# EAGLE design usb-uart (EAGLE 5.06)
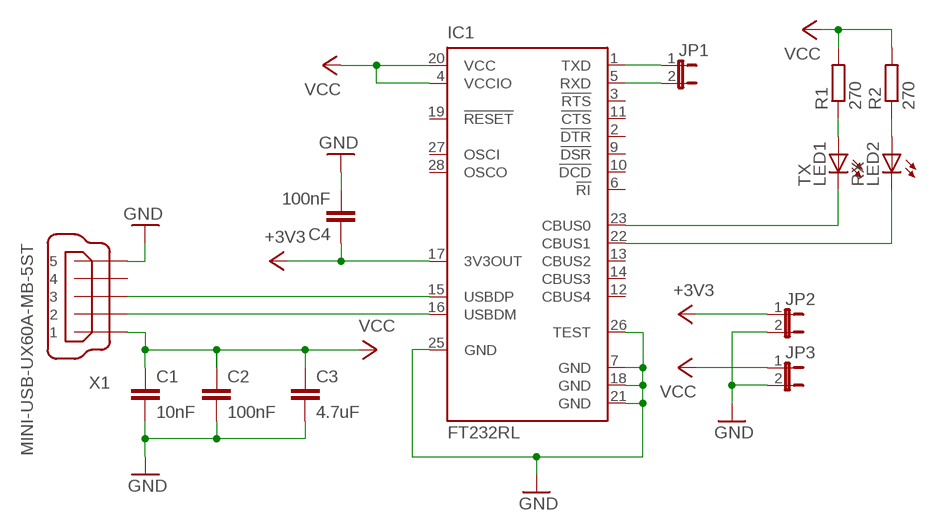
[diagram p0: schematic, sheet 1]

## Parts
C1  10nF  C-EUC0805  [C0805]
C2  100nF  C-EUC0805  [C0805]
C3  4.7uF  C-EUC0805  [C0805]
C4  100nF  C-EUC0805  [C0805]
IC1  FT232RL  [SSOP28]
JP1  JP1E  [JP1]
JP2  JP1E  [JP1]
JP3  JP1E  [JP1]
LED1  TX  LEDCHIPLED_0805  [CHIPLED_0805]
LED2  RX  LEDCHIPLED_0805  [CHIPLED_0805]
R1  270  R-EU_R0805  [R0805]
R2  270  R-EU_R0805  [R0805]
X1  MINI-USB-UX60A-MB-5ST  [UX60A-MB-5ST]

## Nets
+3V3: C4.1 IC1.17(3V3OUT) JP2.1
GND: C1.2 C2.2 C3.2 C4.2 IC1.7(GND) IC1.18(GND) IC1.21(GND) IC1.25(GND) IC1.26(TEST) JP2.2 JP3.2 X1.5
N$1: IC1.16(USBDM) X1.2
N$2: IC1.15(USBDP) X1.3
N$9: IC1.23(CBUS0) LED1.C
N$10: IC1.22(CBUS1) LED2.C
N$11: LED1.A R1.1
N$12: LED2.A R2.1
N$14: IC1.1(TXD) JP1.1
N$15: IC1.5(RXD) JP1.2
VCC: C1.1 C2.1 C3.1 IC1.4(VCCIO) IC1.20(VCC) JP3.1 R1.2 R2.2 X1.1
Unconnected: IC1.2(!DTR) IC1.3(!RTS) IC1.6(!RI) IC1.9(!DSR) IC1.10(!DCD) IC1.11(!CTS) IC1.12(CBUS4) IC1.13(CBUS2) IC1.14(CBUS3) IC1.19(!RESET) IC1.27(OSCI) IC1.28(OSCO) X1.4

## Library data of the parts
C1-C4 = rcl:C-EU: CAPACITOR, European symbol
IC1 = ftdichip:FT232R: Source: http://www.ftdichip.com/Documents/DataSheets/DS_FT232R_v104.pdf
JP1-JP3 = jumper:JP1E: JUMPER
LED1 LED2 = led:LED: LED OSRAM: - CHIPLED LG R971, LG N971, LY N971, LG Q971, LY Q971, LO R971, LY R971 LH N974, LH R974 LS Q976, LO Q976, LY Q976 LO Q996 - Hyper CHIPLED LW Q18S LB Q993, LB Q99A, LB R99A - SideLED LS A670, LO A670, LY A670, LG A670, LP A670 LB A673, LV A673, LT A673, LW A673 LH A674 LY A675 LS A676, LA A676, LO A676, LY A676, LW A676 LS A679, LY A679, LG A679 - Hyper Micro SIDELED® LS Y876, LA Y876, LO Y876, LY Y876 LT Y87S - SmartLED LW L88C, LW L88S LB L89C, LB L89S, LG L890 LS L89K, LO L89K, LY L89K LS L896, LA L896, LO L896, LY L896 - TOPLED LS T670, LO T670, LY T670, LG T670, LP T670 LSG T670, LSP T670, LSY T670, LOP T670, LYG T670 LG T671, LOG T671, LSG T671 LB T673, LV T673, LT T673, LW T673 LH T674 LS T676, LA T676, LO T676, LY T676, LB T676, LH T676, LSB T676, LW T676 LB T67C, LV T67C, LT T67C, LS T67K, LO T67K, LY T67K, LW E67C LS E67B, LA E67B, LO E67B, LY E67B, LB E67C, LV E67C, LT E67C LW T67C LS T679, LY T679, LG T679 LS T770, LO T770, LY T770, LG T770, LP T770 LB T773, LV T773, LT T773, LW T773 LH T774 LS E675, LA E675, LY E675, LS T675 LS T776, LA T776, LO T776, LY T776, LB T776 LHGB T686 LT T68C, LB T68C - Hyper Mini TOPLED® LB M676 - Mini TOPLED Santana® LG M470 LS M47K, LO M47K, LY M47K Source: http://www.osram.convergy.de LUXEON: - LUMILED® LXK2-PW12-R00, LXK2-PW12-S00, LXK2-PW14-U00, LXK2-PW14-V00 LXK2-PM12-R00, LXK2-PM12-S00, LXK2-PM14-U00 LXK2-PE12-Q00, LXK2-PE12-R00, LXK2-PE12-S00, LXK2-PE14-T00, LXK2-PE14-U00 LXK2-PB12-K00, LXK2-PB12-L00, LXK2-PB12-M00, LXK2-PB14-N00, LXK2-PB14-P00, LXK2-PB14-Q00 LXK2-PR12-L00, LXK2-PR12-M00, LXK2-PR14-Q00, LXK2-PR14-R00 LXK2-PD12-Q00, LXK2-PD12-R00, LXK2-PD12-S00 LXK2-PH12-R00, LXK2-PH12-S00 LXK2-PL12-P00, LXK2-PL12-Q00, LXK2-PL12-R00 Source: www.luxeon.com KINGBRIGHT: KA-3528ASYC Source: www.kingbright.com
R1 R2 = rcl:R-EU_: RESISTOR, European symbol
X1 = con-hirose:MINI-USB-: MINI USB Connector Source: http://www.hirose.co.jp/cataloge_hp/e24000019.pdf

## Board
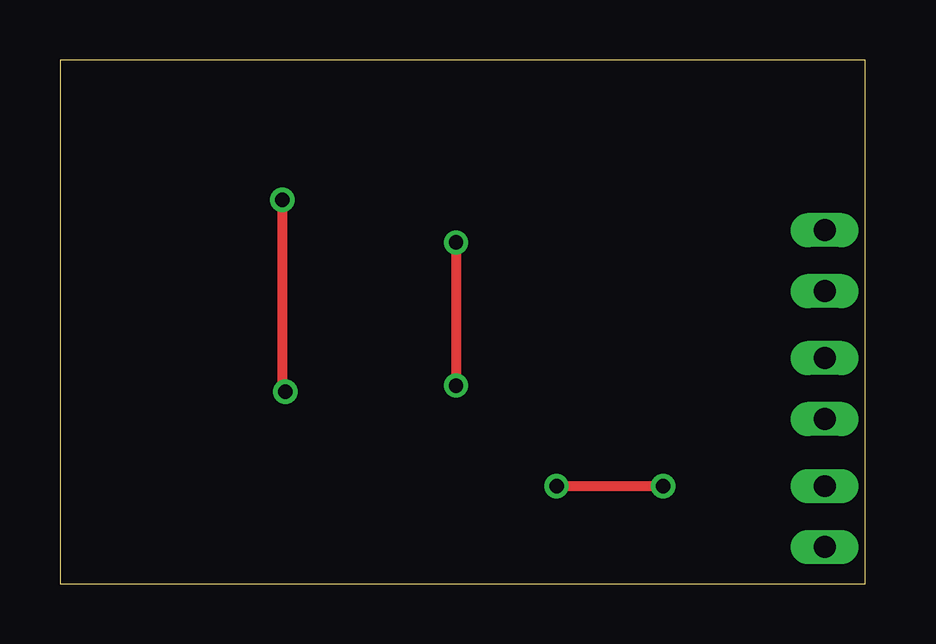
[diagram p1: board, top side]
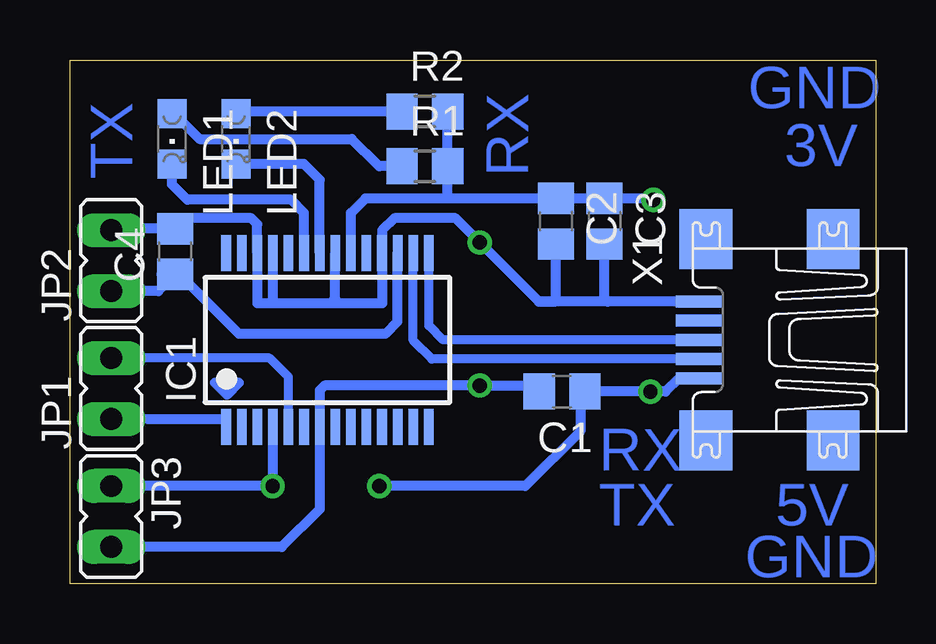
[diagram p2: board, bottom side, seen from below]

Size 33.58 x 21.83 mm. Coordinates in mm from the lower left corner, seen from the top.
Outline: 0,0 33.58,0 33.58,21.83 0,21.83 0,0
Copper layers (1*16): Top 0.035mm / dielectric 1.5mm / Bottom 0.035mm
Design rules "default": minimum track width 10mil, minimum drill 24mil, track to track 8mil, track to pad 8mil, pad to pad 8mil, via to via 8mil, smd to smd 8mil, copper to edge 40mil, drill to drill 8mil, minimum pad ring 10mil, minimum via ring 8mil, stop-mask expansion 4mil, vias tented up to drill 0mil, thermal gap 10mil

### Footprints (pad centres in the part's own frame; a part is rotated, then mirrored left to right if it is on the bottom)
C0805 = smd 1.3 x 1.5: 1 -0.95,0; 2 0.95,0
SSOP28 = smd 0.4 x 1.5: 1 -4.225,-3.625; 2 -3.575,-3.625; 3 -2.925,-3.625; 4 -2.275,-3.625; 5 -1.625,-3.625; 6 -0.975,-3.625; 7 -0.325,-3.625; 8 0.325,-3.625; 9 0.975,-3.625; 10 1.625,-3.625; 11 2.275,-3.625; 12 2.925,-3.625; 13 3.575,-3.625; 14 4.225,-3.625; 15 4.225,3.625; 16 3.575,3.625; 17 2.925,3.625; 18 2.275,3.625; 19 1.625,3.625; 20 0.975,3.625; 21 0.325,3.625; 22 -0.325,3.625; 23 -0.975,3.625; 24 -1.625,3.625; 25 -2.275,3.625; 26 -2.925,3.625; 27 -3.575,3.625; 28 -4.225,3.625
JP1 = drill 0.914 long: 1 0,-1.27; 2 0,1.27
CHIPLED_0805 = smd 1.2 x 1.2: A 0,-1.05; C 0,1.05
R0805 = smd 1.3 x 1.5: 1 -0.95,0; 2 0.95,0
UX60A-MB-5ST = smd 2 x 0.5: 1 2.25,1.6; 2 2.25,0.8; 3 2.25,0; 4 2.25,-0.8; 5 2.25,-1.6 | smd 2.2 x 2.5: M1 -3.3,-4.2; M2 -3.3,4.2; M3 2,4.2; M4 2,-4.2

### Placement (x,y rotation side)
C1  13.08,8 180 bottom
C2  13.34,15.11 270 bottom
C3  11.3,15.11 270 bottom
C4  29.21,13.84 90 bottom
IC1  22.86,10.16 0 bottom
JP1  31.88,8.13 0 bottom
JP2  31.88,13.46 0 bottom
JP3  31.88,2.79 180 bottom
LED1  29.34,18.54 180 bottom
LED2  26.67,18.54 180 bottom
R1  18.8,17.4 0 bottom
R2  18.8,19.69 0 bottom
X1  5.08,10.16 180 bottom

### Tracks (layer width: path | path; a pad name or v marks a point on that pad's centre or on a via)
+3V3
  Bottom 0.406: C4.1 29.02,12.89 26.54,10.41 20.45,10.41 19.94,10.92 IC1.17 | C4.1 29.78,12.89 | JP2.1 29.91,12.19 C4.1
GND  (via drill 0.6)
  Top 0.406: v16.51,14.22 v16.51,8.26
  Bottom 0.406: 22.73,11.68 20.57,11.68 20.59,11.7 IC1.18 20.57,13.8 20.57,14.73 20.07,15.24 17.53,15.24 v16.51,14.22 14.05,11.76 | 22.73,11.68 25.15,11.68 | 25.15,11.68 25.78,11.68 IC1.26 25.79,14.99 26.04,15.24 28.76,15.24 C4.2 31.82,14.79 JP2.2 | IC1.25 25.14,11.7 25.15,11.68 | IC1.21 22.54,11.88 22.73,11.68 | X1.5 11.18,11.76 | C3.2 11.3,11.89 11.18,11.76 | C2.2 13.34,11.81 13.39,11.76 14.05,11.76 | 11.18,11.76 14.05,11.76 | C1.2 14.29,8.26 v16.51,8.26 22.99,8.26 23.18,8.06 IC1.7 23.18,3.1 24.77,1.52 JP3.2
N$1
  Bottom 0.381: X1.2 18.5,9.36 19.29,10.14 IC1.16
N$2
  Bottom 0.381: IC1.15 18.64,10.76 18.03,10.16 X1.3
N$3
  Bottom 0.406: 27.05,7.87 27.56,8.38 26.54,8.38 27.05,7.87
N$9
  Bottom 0.406: IC1.23 23.84,15.45 24.38,16 28.7,16 29.34,16.64 LED1.C
N$10
  Bottom 0.406: LED2.C 23.84,17.49 23.18,16.84 IC1.22
N$11
  Bottom 0.406: R1.1 20.7,17.4 21.84,18.54 28.19,18.54 29.24,19.59 LED1.A
N$12
  Bottom 0.406: R2.1 26.58,19.69 LED2.A
N$14
  Bottom 0.381: 30.35,6.86 JP1.1
  Bottom 0.406: 30.35,6.86 27.09,6.86 IC1.1
N$15
  Bottom 0.381: JP1.2 25.27,9.4 24.48,8.61 IC1.5
VCC  (via drill 0.6)
  Top 0.406: v9.27,16 9.27,8.13 v9.4,8 | v20.7,4.06 v25.15,4.06
  Bottom 0.406: IC1.20 21.89,15.45 21.27,16.06 17.85,16.06 | R2.2 R1.2 17.85,16.06 | v9.27,16 9.33,16.06 C3.1 C2.1 17.85,16.06 | X1.1 8.2,8.56 8.76,8 v9.4,8 C1.1 12.32,7.81 12.32,6.35 14.61,4.06 v20.7,4.06 | JP3.1 v25.15,4.06 25.14,4.08 IC1.4

### Text on the board
Bottom: RX | GND | TX | 3V | RX | 5V | TX | GND